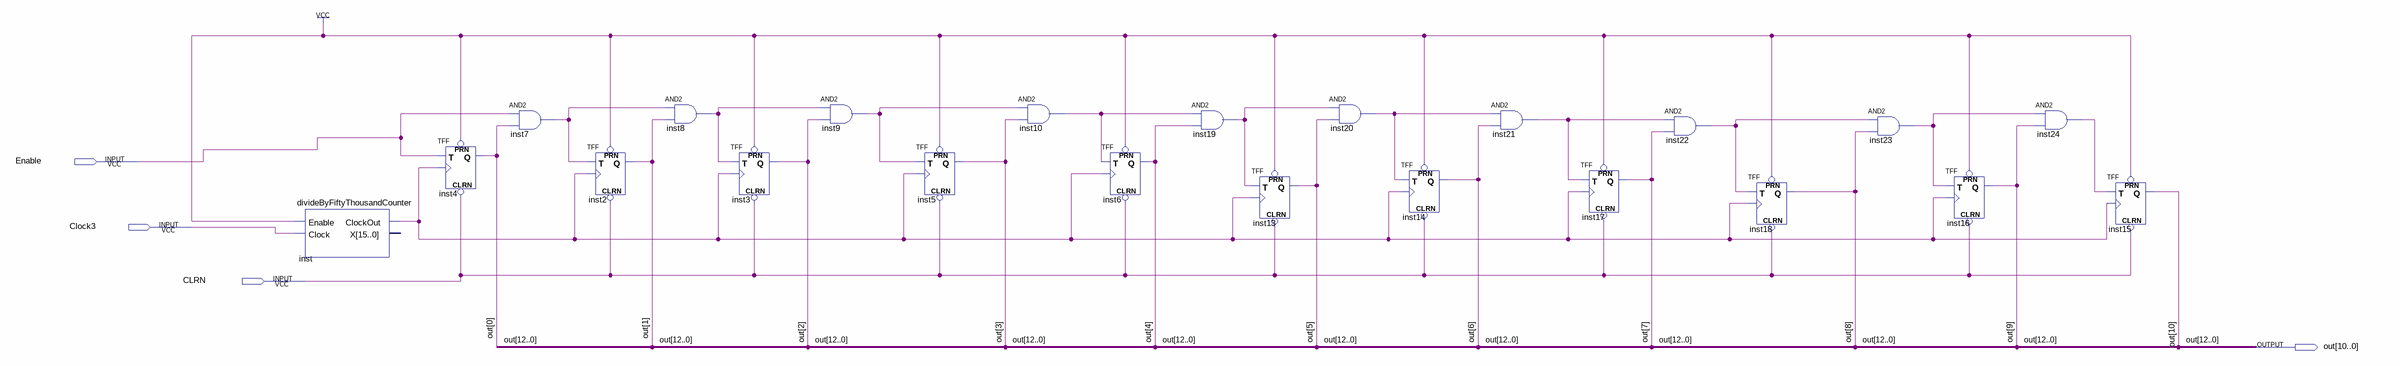
[diagram p0: schematic sheet]
// Quartus schematic delayCounter.bdf as structural Verilog: 22 symbols, 4 pins
module delayCounter (
  input  Enable,
  input  Clock3,
  input  CLRN,
  output [10:0] out
);

  wire inst7_out, inst8_out, inst9_out, inst10_out, inst19_out, inst20_out, inst21_out, inst22_out,
       inst23_out, inst24_out, inst_clockout;

  divideByFiftyThousandCounter inst (.Enable(1'b1), .Clock(Clock3), .ClockOut(inst_clockout));  // open: X
  TFF inst4 (.PRN(1'b1), .CLRN(CLRN), .T(Enable), .CLK(inst_clockout), .Q(out[0]));
  and inst7 (inst7_out, Enable, out[0]);
  TFF inst2 (.PRN(1'b1), .CLRN(CLRN), .T(inst7_out), .CLK(inst_clockout), .Q(out[1]));
  and inst8 (inst8_out, inst7_out, out[1]);
  TFF inst3 (.PRN(1'b1), .CLRN(CLRN), .T(inst8_out), .CLK(inst_clockout), .Q(out[2]));
  and inst9 (inst9_out, inst8_out, out[2]);
  TFF inst5 (.PRN(1'b1), .CLRN(CLRN), .T(inst9_out), .CLK(inst_clockout), .Q(out[3]));
  and inst10 (inst10_out, inst9_out, out[3]);
  TFF inst6 (.PRN(1'b1), .CLRN(CLRN), .T(inst10_out), .CLK(inst_clockout), .Q(out[4]));
  and inst19 (inst19_out, inst10_out, out[4]);
  TFF inst13 (.PRN(1'b1), .CLRN(CLRN), .T(inst19_out), .CLK(inst_clockout), .Q(out[5]));
  and inst20 (inst20_out, inst19_out, out[5]);
  TFF inst14 (.PRN(1'b1), .CLRN(CLRN), .T(inst20_out), .CLK(inst_clockout), .Q(out[6]));
  and inst21 (inst21_out, inst20_out, out[6]);
  TFF inst17 (.PRN(1'b1), .CLRN(CLRN), .T(inst21_out), .CLK(inst_clockout), .Q(out[7]));
  and inst22 (inst22_out, inst21_out, out[7]);
  TFF inst18 (.PRN(1'b1), .CLRN(CLRN), .T(inst22_out), .CLK(inst_clockout), .Q(out[8]));
  and inst23 (inst23_out, inst22_out, out[8]);
  TFF inst16 (.PRN(1'b1), .CLRN(CLRN), .T(inst23_out), .CLK(inst_clockout), .Q(out[9]));
  and inst24 (inst24_out, inst23_out, out[9]);
  TFF inst15 (.PRN(1'b1), .CLRN(CLRN), .T(inst24_out), .CLK(inst_clockout), .Q(out[10]));
endmodule
